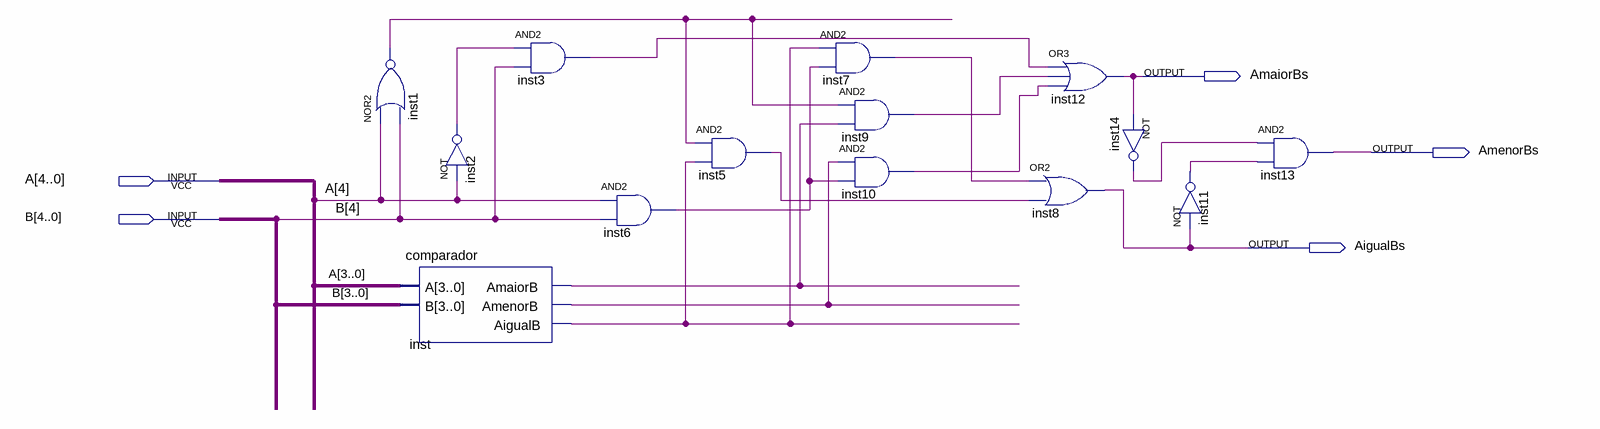
[diagram p0: schematic sheet]
// Quartus schematic comparadorSinal.bdf as structural Verilog: 14 symbols, 5 pins
module comparadorSinal (
  input  [4:0] A,
  input  [4:0] B,
  output AmaiorBs,
  output AmenorBs,
  output AigualBs
);

  wire inst1_out, inst2_out, inst3_out, inst5_out, inst6_out, inst7_out, inst9_out, inst10_out, inst11_out,
       inst14_out, inst_aigualb, inst_amaiorb, inst_amenorb;

  nor inst1 (inst1_out, A[4], B[4]);
  not inst2 (inst2_out, A[4]);
  comparador inst (.A(A[3:0]), .B(B[3:0]), .AmaiorB(inst_amaiorb), .AmenorB(inst_amenorb), .AigualB(inst_aigualb));
  and inst3 (inst3_out, inst2_out, B[4]);
  and inst6 (inst6_out, A[4], B[4]);
  and inst5 (inst5_out, inst1_out, inst_aigualb);
  and inst7 (inst7_out, inst_aigualb, inst6_out);
  and inst9 (inst9_out, inst1_out, inst_amaiorb);
  and inst10 (inst10_out, inst_amenorb, inst6_out);
  or inst12 (AmaiorBs, inst3_out, inst9_out, inst10_out);
  or inst8 (AigualBs, inst7_out, inst5_out);
  not inst14 (inst14_out, AmaiorBs);
  not inst11 (inst11_out, AigualBs);
  and inst13 (AmenorBs, inst14_out, inst11_out);
endmodule
